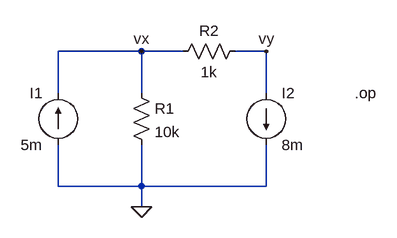
[diagram p0: schematic example1.asc]
example1.asc, the LTspice schematic file:
Version 4
SHEET 1 880 680
WIRE 96 48 -32 48
WIRE 160 48 96 48
WIRE 288 48 240 48
WIRE -32 112 -32 48
WIRE 96 112 96 48
WIRE 288 112 288 48
WIRE -32 256 -32 192
WIRE 96 256 96 192
WIRE 96 256 -32 256
WIRE 288 256 288 192
WIRE 288 256 96 256
WIRE 96 288 96 256
FLAG 96 288 0
FLAG 96 48 vx
FLAG 288 48 vy
SYMBOL current -32 192 R180
WINDOW 0 24 80 Left 2
WINDOW 3 24 0 Left 2
WINDOW 123 0 0 Left 0
WINDOW 39 0 0 Left 0
SYMATTR InstName I1
SYMATTR Value 5m
SYMBOL current 288 112 R0
SYMATTR InstName I2
SYMATTR Value 8m
SYMBOL res 80 96 R0
SYMATTR InstName R1
SYMATTR Value 10k
SYMBOL res 256 32 R90
WINDOW 0 0 56 VBottom 2
WINDOW 3 32 56 VTop 2
SYMATTR InstName R2
SYMATTR Value 1k
TEXT 424 112 Left 2 !.op

The netlist it stands for:
* example1.asc
I1 0 vx 5m
I2 vy 0 8m
R1 vx 0 10k
R2 vy vx 1k
.op
.backanno
.end